# EAGLE schematic strobe (EAGLE 7.7.0)
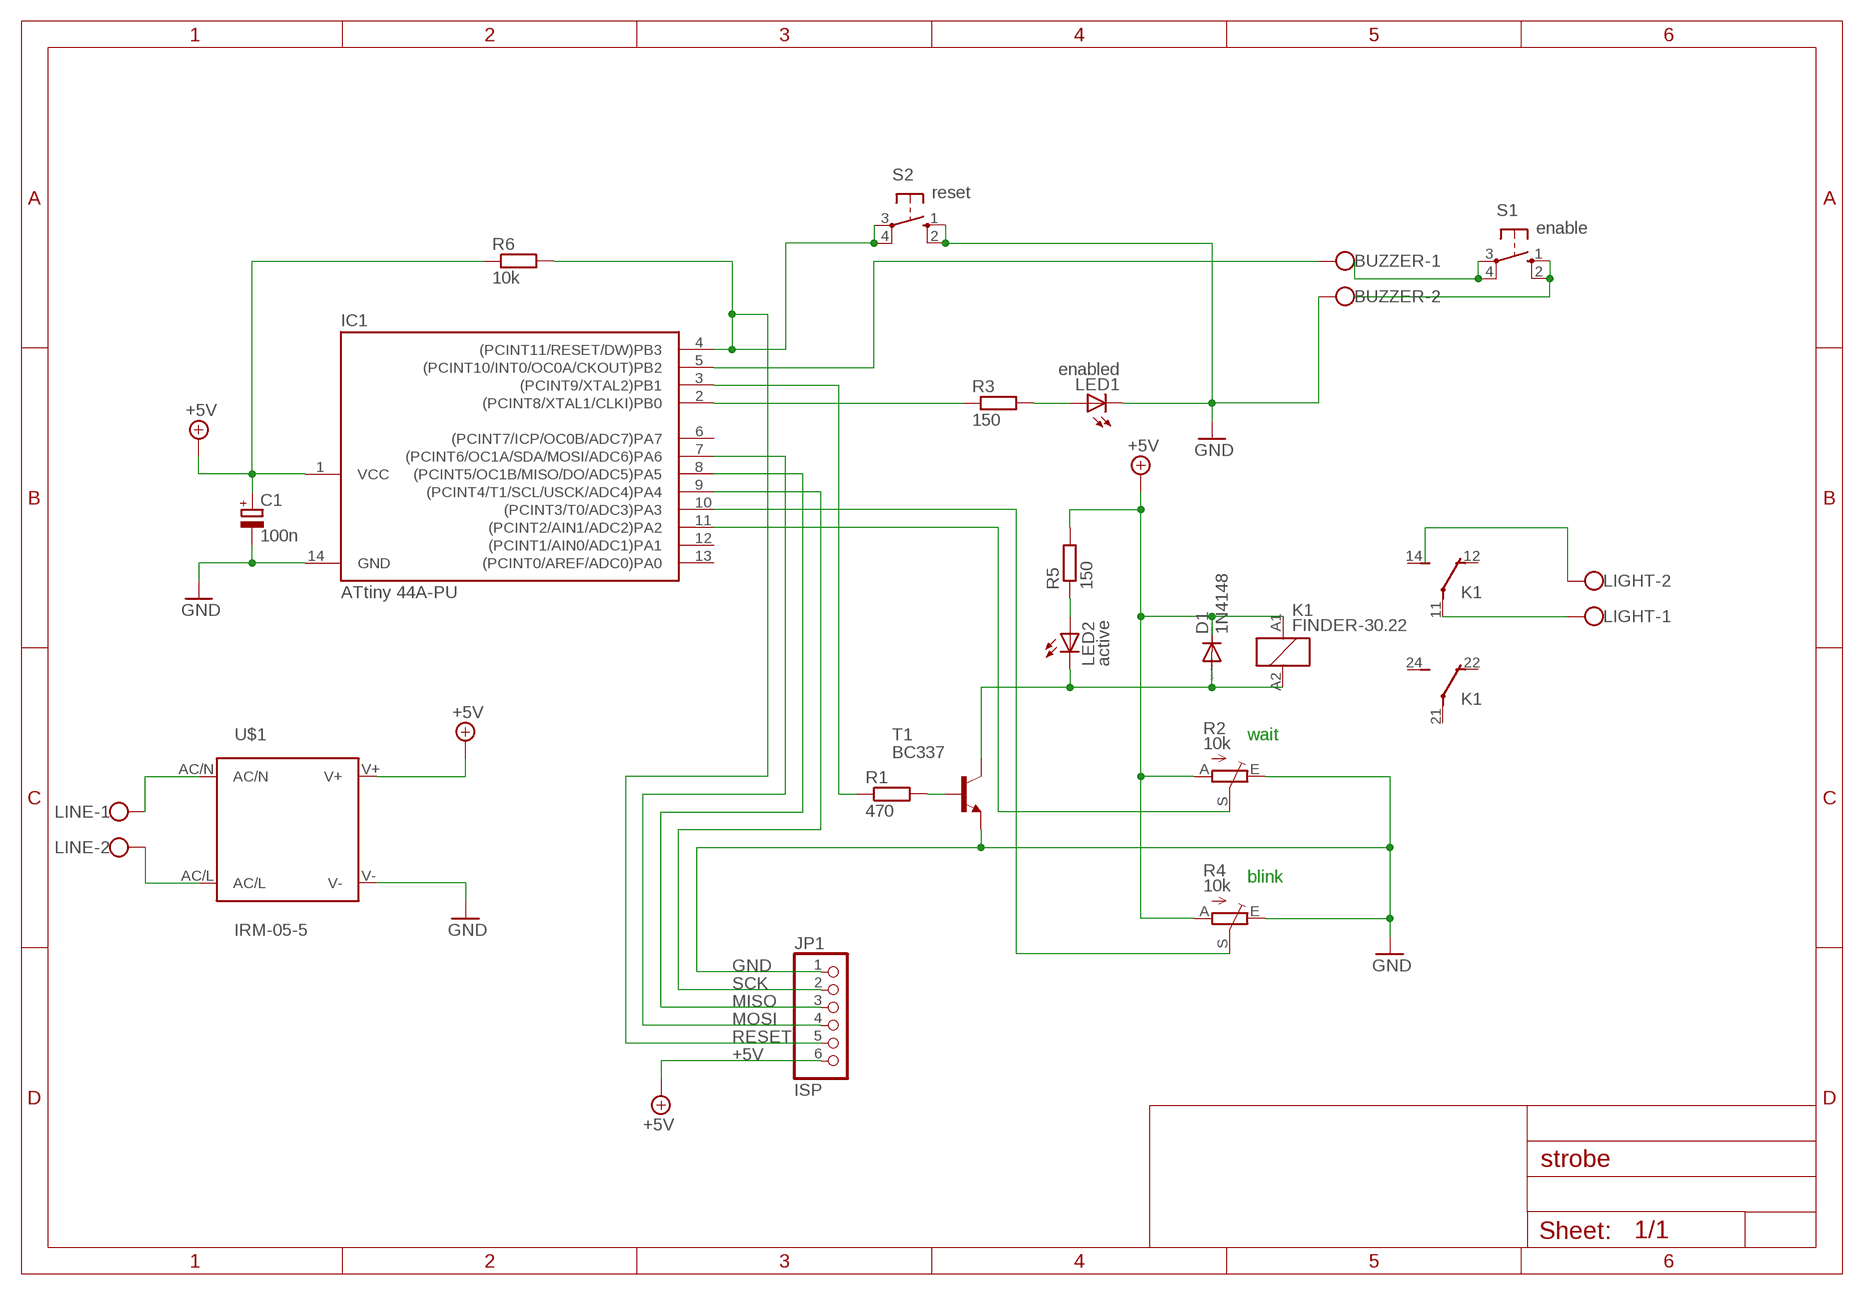
[diagram p0: schematic, sheet 1]

## Parts
BUZZER  W237-102  [W237-102]
C1  100n  CPOL-EUE2,5-6E  [E2,5-6E]
D1  1N4148  1N4148DO35-7  [DO35-7]
IC1  ATtiny 44A-PU  ATTINY24/44/84-PU  [DIL14]
JP1  ISP  PINHD-1X6  [1X06]
K1  FINDER-30.22  [FINDER-30.22]
LED1  enabled  LED3MM  [LED3MM]
LED2  active  LED3MM  [LED3MM]
LIGHT  W237-102  [W237-102]
LINE  W237-102  [W237-102]
R1  470  R-EU_0207/10  [0207/10]
R2  10k  TRIM_EU-CA6V  [CA6V]
R3  150  R-EU_0207/10  [0207/10]
R4  10k  TRIM_EU-CA6V  [CA6V]
R5  150  R-EU_0207/10  [0207/10]
R6  10k  R-EU_0207/10  [0207/10]
S1  enable  10-XX  [B3F-10XX]
S2  reset  10-XX  [B3F-10XX]
T1  BC337  [TO92]
U$1  IRM-05-5  IRM_05/10  [IRM_05/10]

## Nets
+5V: C1.+ D1.C IC1.1(VCC) JP1.6 K1.A1 R2.A R4.A R5.2 R6.1
GND: BUZZER.2 C1.- IC1.14(GND) JP1.1 LED1.K(C) R2.E R4.E S2.1(S) S2.2(S1) T1.1(E) U$1.V-
MISO: IC1.8((PCINT5/OC1B/MISO/DO/ADC5)PA5) JP1.3
MOSI: IC1.7((PCINT6/OC1A/SDA/MOSI/ADC6)PA6) JP1.4
N$1: LINE.1 U$1.AC/N
N$2: LINE.2
N$3: IC1.3((PCINT9/XTAL2)PB1) R1.1
N$4: R1.2 T1.2(B)
N$5: IC1.11((PCINT2/AIN1/ADC2)PA2) R2.S
N$9: LIGHT.2
N$10: IC1.10((PCINT3/T0/ADC3)PA3) R4.S
N$11: D1.A K1.A2 LED2.K(C) T1.3(C)
N$12: LED1.A R3.2
N$13: IC1.2((PCINT8/XTAL1/CLKI)PB0) R3.1
N$14: BUZZER.1 IC1.5((PCINT10/INT0/OC0A/CKOUT)PB2)
N$15: K1.11(-1:P) LIGHT.1
N$17: LED2.A R5.1
N$18: S1.1(S) S1.2(S1)
N$19: S1.3(P) S1.4(P1)
RESET: IC1.4((PCINT11/RESET/DW)PB3) JP1.5 R6.2 S2.3(P) S2.4(P1)
SCK: IC1.9((PCINT4/T1/SCL/USCK/ADC4)PA4) JP1.2
Unconnected: IC1.6((PCINT7/ICP/OC0B/ADC7)PA7) IC1.12((PCINT1/AIN0/ADC1)PA1) IC1.13((PCINT0/AREF/ADC0)PA0) K1.12(-1:O) K1.14(-1:S) K1.21(-2:P) K1.22(-2:O) K1.24(-2:S) U$1.AC/L U$1.V+

## Notes on the sheet
- wait
- blink

## Library data of the parts
BUZZER LIGHT LINE = con-wago-500:W237-102: WAGO SCREW CLAMP; MPN: 237-102; OC_FARNELL: unknown; OC_NEWARK: 70K9898
C1 = rcl:CPOL-EU: POLARIZED CAPACITOR, European symbol
D1 = diode:1N4148: DIODE high speed (Philips)
IC1 = attiny24_44_84:ATTINY24/44/84
JP1 = pinhead:PINHD-1X6: PIN HEADER
K1 = relay:FINDER-30.22: SUBMINIATURE DIL-RELAIS FINDER 30.22.9.024.0000 Kontakt max. AC - 125V Distributor: Farnell Bestell Nr.: 1217371 Source: http://www.farnell.com/datasheets/87634.pdf; OC_FARNELL: unknown; OC_NEWARK: unknown
LED1 LED2 = led:LED: LED OSRAM: - CHIPLED LG R971, LG N971, LY N971, LG Q971, LY Q971, LO R971, LY R971 LH N974, LH R974 LS Q976, LO Q976, LY Q976 LO Q996 - Hyper CHIPLED LW Q18S LB Q993, LB Q99A, LB R99A - SideLED LS A670, LO A670, LY A670, LG A670, LP A670 LB A673, LV A673, LT A673, LW A673 LH A674 LY A675 LS A676, LA A676, LO A676, LY A676, LW A676 LS A679, LY A679, LG A679 - Hyper Micro SIDELED® LS Y876, LA Y876, LO Y876, LY Y876 LT Y87S - SmartLED LW L88C, LW L88S LB L89C, LB L89S, LG L890 LS L89K, LO L89K, LY L89K LS L896, LA L896, LO L896, LY L896 - TOPLED LS T670, LO T670, LY T670, LG T670, LP T670 LSG T670, LSP T670, LSY T670, LOP T670, LYG T670 LG T671, LOG T671, LSG T671 LB T673, LV T673, LT T673, LW T673 LH T674 LS T676, LA T676, LO T676, LY T676, LB T676, LH T676, LSB T676, LW T676 LB T67C, LV T67C, LT T67C, LS T67K, LO T67K, LY T67K, LW E67C LS E67B, LA E67B, LO E67B, LY E67B, LB E67C, LV E67C, LT E67C LW T67C LS T679, LY T679, LG T679 LS T770, LO T770, LY T770, LG T770, LP T770 LB T773, LV T773, LT T773, LW T773 LH T774 LS E675, LA E675, LY E675, LS T675 LS T776, LA T776, LO T776, LY T776, LB T776 LHGB T686 LT T68C, LB T68C - Hyper Mini TOPLED® LB M676 - Mini TOPLED Santana® LG M470 LS M47K, LO M47K, LY M47K Source: http://www.osram.convergy.de LUXEON: - LUMILED® LXK2-PW12-R00, LXK2-PW12-S00, LXK2-PW14-U00, LXK2-PW14-V00 LXK2-PM12-R00, LXK2-PM12-S00, LXK2-PM14-U00 LXK2-PE12-Q00, LXK2-PE12-R00, LXK2-PE12-S00, LXK2-PE14-T00, LXK2-PE14-U00 LXK2-PB12-K00, LXK2-PB12-L00, LXK2-PB12-M00, LXK2-PB14-N00, LXK2-PB14-P00, LXK2-PB14-Q00 LXK2-PR12-L00, LXK2-PR12-M00, LXK2-PR14-Q00, LXK2-PR14-R00 LXK2-PD12-Q00, LXK2-PD12-R00, LXK2-PD12-S00 LXK2-PH12-R00, LXK2-PH12-S00 LXK2-PL12-P00, LXK2-PL12-Q00, LXK2-PL12-R00 Source: www.luxeon.com KINGBRIGHT: KA-3528ASYC Source: www.kingbright.com
R1 R3 R5 R6 = resistor:R-EU_: RESISTOR, European symbol
R2 R4 = pot:TRIM_EU-: POTENTIOMETER
S1 S2 = switch-omron:10-XX: OMRON SWITCH; MPN: B3F-1000; OC_FARNELL: 176432; OC_NEWARK: 36M3542
T1 = transistor:BC337: NPN TRANSISTOR
U$1 = meanwell_irm_v5:IRM_05/10: 5 or 10 watt housing & pin compatible IRM 05 Vout [V] Imax [A] Pmax [W] Eff [%] 3.3 1.25 4.125 68 5 1 5 71 12 0.42 5.04 75 15 0.33 4.95 75 24 0.23 5.52 77 IRM 10 Vout [V] Imax [A] Pmax [W] Eff [%] 3.3 2.5 8.25 74 5 2 10 77 12 0.85 10.2 82 15 0.67 10.05 82 24 0.42 10.08 82